# Altium schematic sheet 01_Structure.SchDoc: Board Structure Illustration
size 381 x 266 mm; Organization: Meteroi; Address1: Room 428, 410 Guiping Rd.; Address2: Shanghai 200233, CHINA; SheetNumber: 1; SheetTotal: 10; PageSetup: Record=PageOptions|CenterHorizontal=True|CenterVertical=True|PrintScale=0.75|XCorrection=1.00|YCorrection=1.00|PrintKind=2|BorderSize=5000000|LeftOffset=0|BottomOffset=0|Orientation=2|PaperLength=1000|PaperWidth=1000|Scale=100|PaperSource=276|PrintQuality=-3|MediaType=1|DitherType=10|PaperKind=A4|PrintScaleMode=1
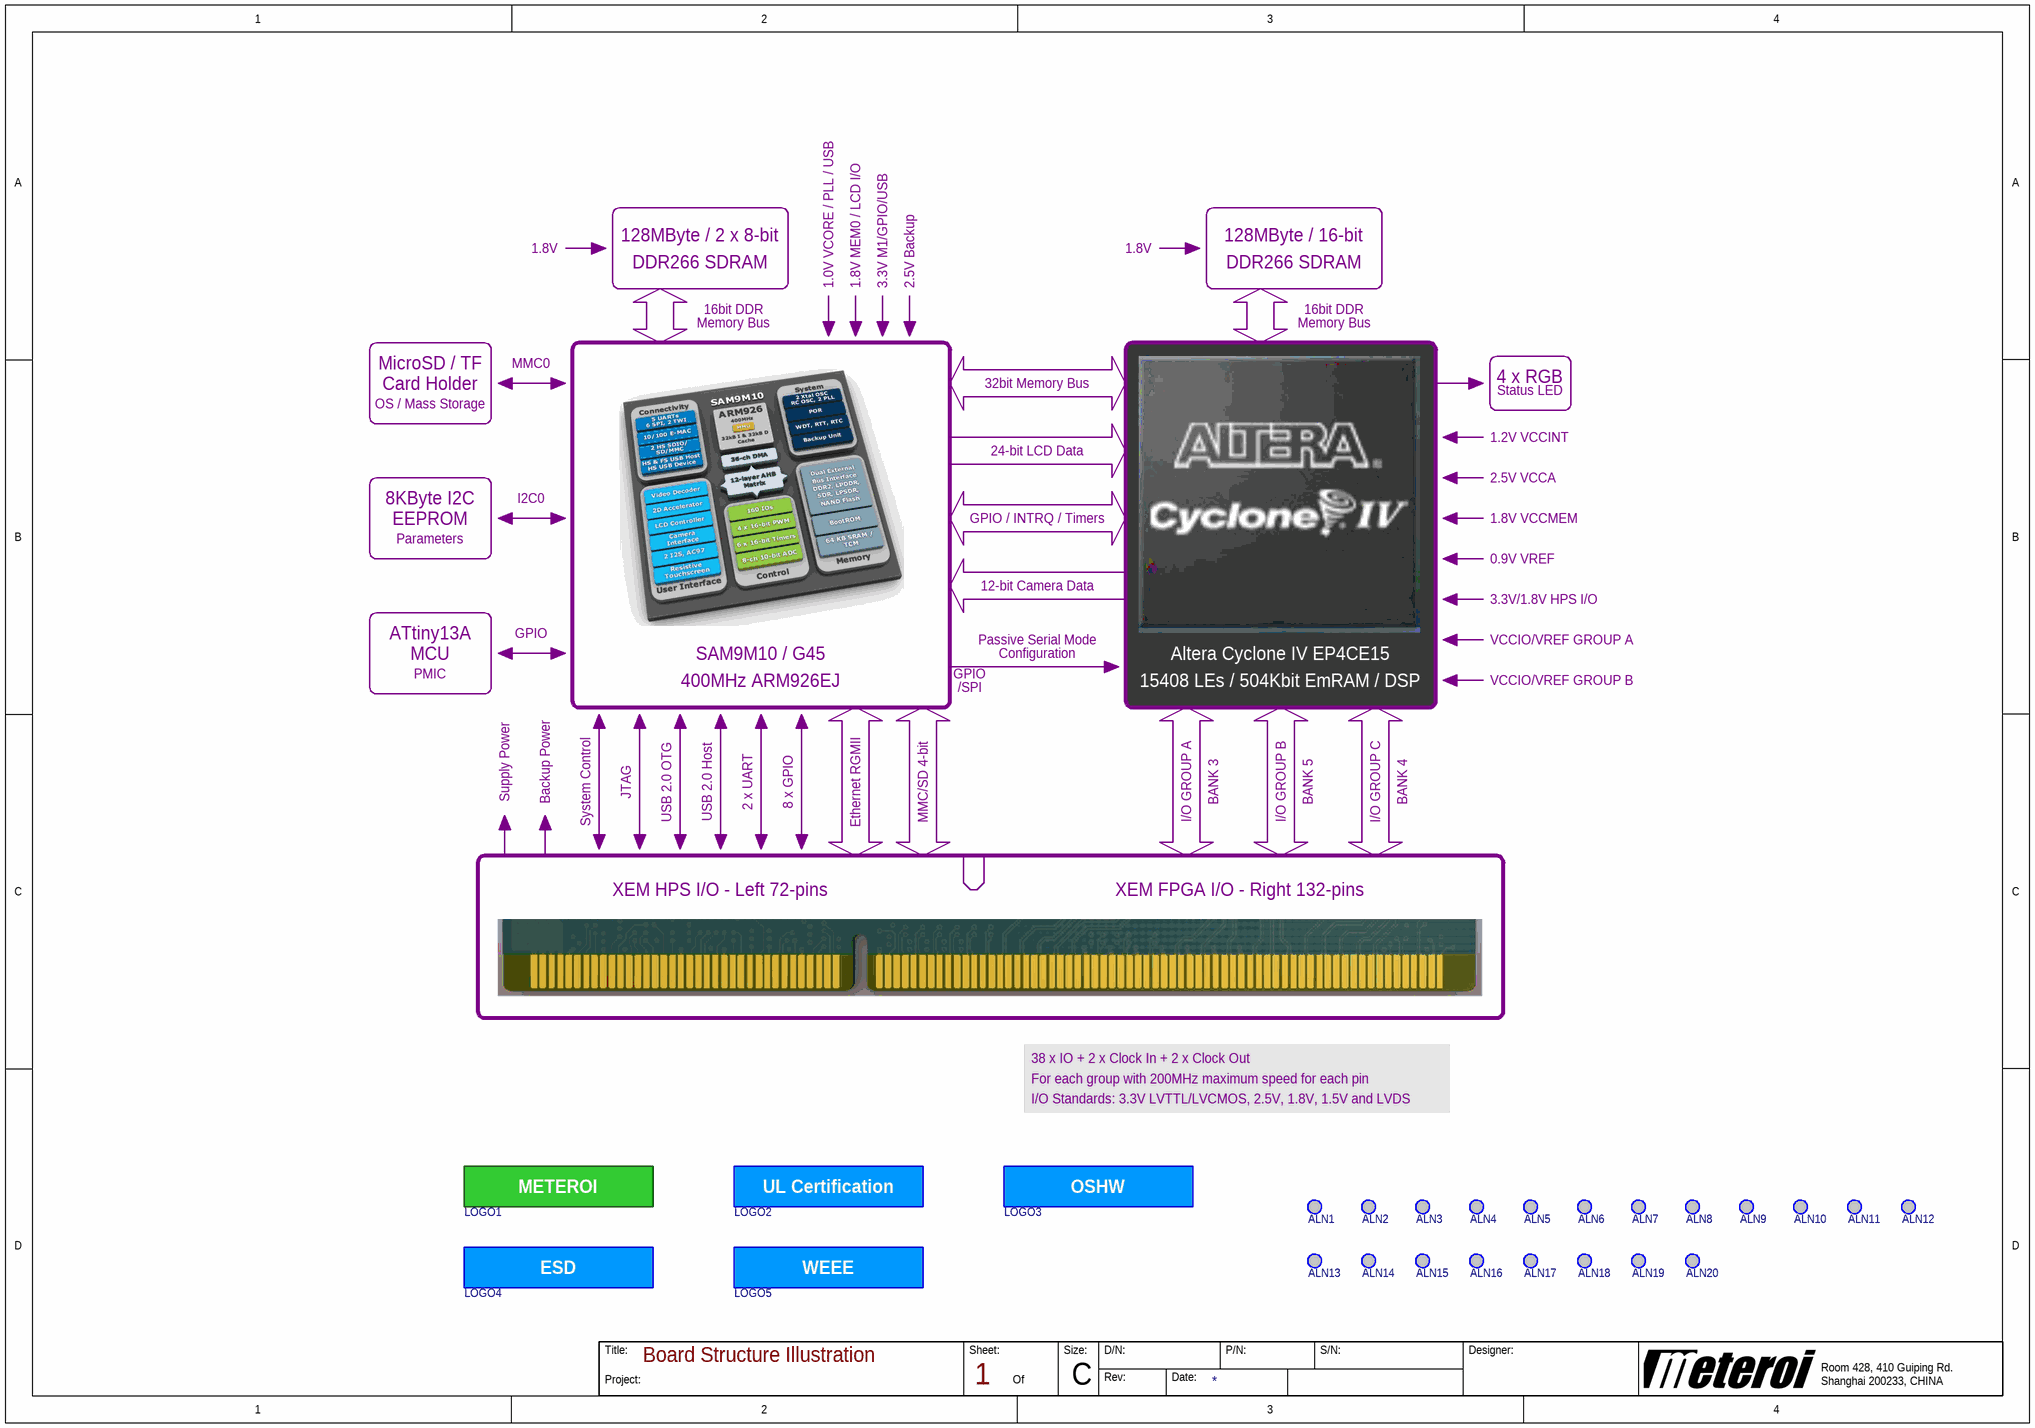
[diagram p0: 01_Structure.SchDoc]

## Parts
ALN1  Assembly Optical Align  [ALIGN_2]  (value not drawn)
ALN2  Assembly Optical Align  [ALIGN_2]  (value not drawn)
ALN3  Assembly Optical Align  [ALIGN_2]  (value not drawn)
ALN4  Assembly Optical Align  [ALIGN_2]  (value not drawn)
ALN5  Assembly Optical Align  [ALIGN_2]  (value not drawn)
ALN6  Assembly Optical Align  [ALIGN_2]  (value not drawn)
ALN7  Assembly Optical Align  [ALIGN_2]  (value not drawn)
ALN8  Assembly Optical Align  [ALIGN_2]  (value not drawn)
ALN9  Assembly Optical Align  [ALIGN_2]  (value not drawn)
ALN10  Assembly Optical Align  [ALIGN_2]  (value not drawn)
ALN11  Assembly Optical Align  [ALIGN_2]  (value not drawn)
ALN12  Assembly Optical Align  [ALIGN_2]  (value not drawn)
ALN13  Assembly Optical Align  [ALIGN_2]  (value not drawn)
ALN14  Assembly Optical Align  [ALIGN_2]  (value not drawn)
ALN15  Assembly Optical Align  [ALIGN_2]  (value not drawn)
ALN16  Assembly Optical Align  [ALIGN_2]  (value not drawn)
ALN17  Assembly Optical Align  [ALIGN_2]  (value not drawn)
ALN18  Assembly Optical Align  [ALIGN_2]  (value not drawn)
ALN19  Assembly Optical Align  [ALIGN_2]  (value not drawn)
ALN20  Assembly Optical Align  [ALIGN_2]  (value not drawn)
LOGO1  LOGO  [LOGO_METEROI_ST_12X3]  (value not drawn)
LOGO2  UL Certification  [REGULATION_PCB_UL]  (value not drawn)
LOGO3  OSHW  [LOGO_OSHW_1]  (value not drawn)
LOGO4  ESD  [REGULATION_ESD]  (value not drawn)
LOGO5  WEEE  [REGULATION_WEEE]  (value not drawn)

## Notes on the sheet
- 128MByte / 2 x 8-bit
- 128MByte / 16-bit
- 1.8V
- DDR266 SDRAM
- 1.0V VCORE / PLL / USB
- 1.8V MEM0 / LCD I/O
- 3.3V M1/GPIO/USB
- 2.5V Backup
- MicroSD / TF
- MMC0
- 16bit DDR
- Memory Bus
- 4 x RGB
- Card Holder
- OS / Mass Storage
- 32bit Memory Bus
- 1.2V VCCINT
- Status LED
- 8KByte I2C
- I2C0
- 24-bit LCD Data
- 2.5V VCCA
- EEPROM
- Parameters
- GPIO / INTRQ / Timers
- 1.8V VCCMEM
- 0.9V VREF
- ATtiny13A
- GPIO
- 12-bit Camera Data
- Passive Serial Mode
- 3.3V/1.8V HPS I/O
- VCCIO/VREF GROUP A
- MCU
- PMIC
- SAM9M10 / G45
- 400MHz ARM926EJ
- /SPI
- Configuration
- Altera Cyclone IV EP4CE15
- 15408 LEs / 504Kbit EmRAM / DSP
- VCCIO/VREF GROUP B
- Supply Power
- Backup Power
- System Control
- JTAG
- USB 2.0 OTG
- USB 2.0 Host
- 2 x UART
- 8 x GPIO
- Ethernet RGMII
- MMC/SD 4-bit
- I/O GROUP A
- BANK 3
- I/O GROUP B
- BANK 5
- I/O GROUP C
- BANK 4
- XEM HPS I/O - Left 72-pins
- XEM FPGA I/O - Right 132-pins
- 38 x IO + 2 x Clock In + 2 x Clock Out
- For each group with 200MHz maximum speed for each pin
- I/O Standards: 3.3V LVTTL/LVCMOS, 2.5V, 1.8V, 1.5V and LVDS
- Title:
- Project:
- Sheet:
- Of
- Size:
- D/N:
- Rev:
- Date:
- P/N:
- S/N:
- Designer:
- C
- (in symbol LOGO_METEROI) METEROI

## Library data of the parts
ALN1-ALN20 = ALIGN: Vendor: 0; Designer: shyul; PCBMarker: Aligner; Value: Assembly Optical Align; Version: 1.0; VersionDate: 05-21-2011; SerialNumber: 0; PartNumber: 0; Publisher: Cowin
LOGO1 = LOGO_METEROI: Meteroi Logo; Vendor: 0; Designer: shyul; Value: LOGO; Version: 1.0; VersionDate: 05-15-2011; SerialNumber: 0; PartNumber: 0; Publisher: Cowin; PCBMarker: LOGO
LOGO2 = REGULATION_PCB_UL: PCB UL Certification; Vendor: 0; Designer: shyul; Value: UL Certification; Version: 1.0; VersionDate: 05-15-2011; SerialNumber: 0; PartNumber: 0; Publisher: Cowin; PCBMarker: UL Certification
LOGO3 = REGULATION_OSHW: OSHW Logo; Vendor: 0; Designer: shyul; Value: OSHW; Version: 1.0; VersionDate: 06-02-2012; SerialNumber: 0; PartNumber: 0; Publisher: Cowin; PCBMarker: OSHW
LOGO4 = REGULATION_ESD: ESD Logo; Vendor: 0; Designer: shyul; Value: ESD; Version: 1.0; VersionDate: 05-15-2011; SerialNumber: 0; PartNumber: 0; Publisher: Cowin; PCBMarker: ESD
LOGO5 = REGULATION_WEEE: WEEE Logo; Vendor: 0; Designer: shyul; Value: WEEE; Version: 1.0; VersionDate: 05-15-2011; SerialNumber: 0; PartNumber: 0; Publisher: Cowin; PCBMarker: WEEE